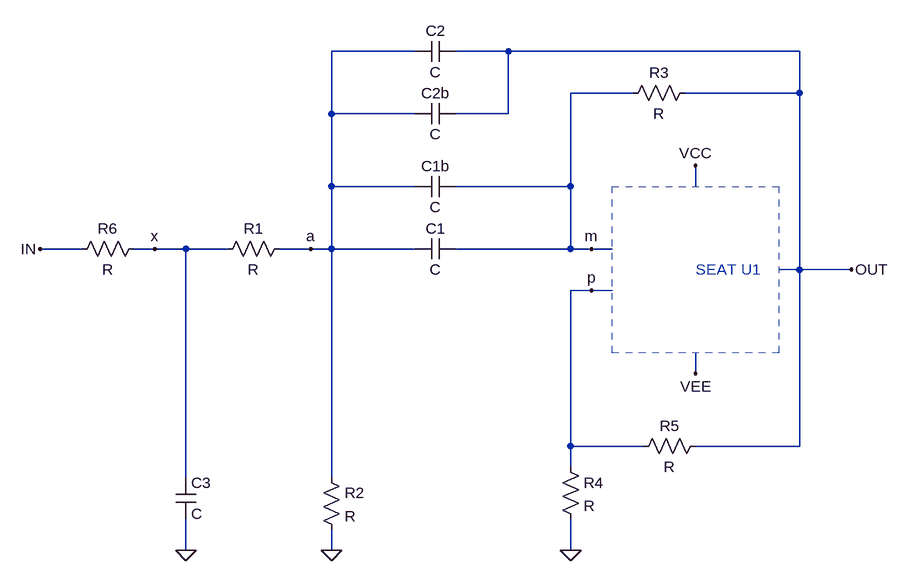
[diagram p0: schematic MFB_BP1LP.asc]
MFB_BP1LP.asc, the LTspice schematic file:
Version 4.1
SHEET 1 980 680
WIRE 240 -128 112 -128
WIRE 384 -128 304 -128
WIRE 832 -128 384 -128
WIRE 576 -64 480 -64
WIRE 832 -64 832 -128
WIRE 832 -64 656 -64
WIRE 112 -32 112 -128
WIRE 240 -32 112 -32
WIRE 384 -32 384 -128
WIRE 384 -32 304 -32
WIRE 112 80 112 -32
WIRE 240 80 112 80
WIRE 480 80 480 -64
WIRE 480 80 304 80
WIRE 672 80 672 48
WIRE 480 176 480 80
WIRE -272 176 -336 176
WIRE -160 176 -192 176
WIRE -112 176 -160 176
WIRE -48 176 -112 176
WIRE 80 176 32 176
WIRE 112 176 112 80
WIRE 112 176 80 176
WIRE 240 176 112 176
WIRE 480 176 304 176
WIRE 512 176 480 176
WIRE 544 176 512 176
WIRE 832 208 832 -64
WIRE 832 208 800 208
WIRE 912 208 832 208
WIRE 512 240 480 240
WIRE 544 240 512 240
WIRE 672 368 672 336
WIRE 480 480 480 240
WIRE 592 480 480 480
WIRE 832 480 832 208
WIRE 832 480 672 480
WIRE 480 512 480 480
WIRE -112 528 -112 176
WIRE 112 528 112 176
WIRE -112 640 -112 592
WIRE 112 640 112 608
WIRE 480 640 480 592
FLAG 912 208 OUT
FLAG 672 48 VCC
FLAG 672 368 VEE
FLAG 512 176 m
FLAG 512 240 p
FLAG -160 176 x
FLAG -336 176 IN
FLAG 80 176 a
FLAG 480 640 0
FLAG -112 640 0
FLAG 112 640 0
SYMBOL res 48 160 R90
WINDOW 0 0 56 VBottom 2
WINDOW 3 32 56 VTop 2
SYMATTR InstName R1
SYMBOL res 672 -80 R90
WINDOW 0 0 56 VBottom 2
WINDOW 3 32 56 VTop 2
SYMATTR InstName R3
SYMBOL res 464 496 R0
SYMATTR InstName R4
SYMBOL res 688 464 R90
WINDOW 0 0 56 VBottom 2
WINDOW 3 32 56 VTop 2
SYMATTR InstName R5
SYMBOL cap 304 -144 R90
WINDOW 0 0 32 VBottom 2
WINDOW 3 32 32 VTop 2
SYMATTR InstName C2
SYMBOL cap 304 64 R90
WINDOW 3 32 32 VTop 2
WINDOW 0 0 32 VBottom 2
SYMATTR InstName C1b
SYMBOL cap 304 -48 R90
WINDOW 0 0 32 VBottom 2
WINDOW 3 32 32 VTop 2
SYMATTR InstName C2b
SYMBOL res 96 512 R0
SYMATTR InstName R2
SYMBOL cap 304 160 R90
WINDOW 0 0 32 VBottom 2
WINDOW 3 32 32 VTop 2
SYMATTR InstName C1
SYMBOL res -176 160 R90
WINDOW 0 0 56 VBottom 2
WINDOW 3 32 56 VTop 2
SYMATTR InstName R6
SYMBOL cap -128 528 R0
SYMATTR InstName C3
TEXT 672 208 Left 2 ;SEAT U1
RECTANGLE Normal 544 80 800 336 2

The netlist it stands for:
* MFB_BP1LP.asc
R1 a x R
R3 OUT m R
R4 p 0 R
R5 OUT p R
C2 OUT a C
C1b m a C
C2b OUT a C
R2 a 0 R
C1 m a C
R6 x IN R
C3 x 0 C
* SEAT U1
.backanno
.end